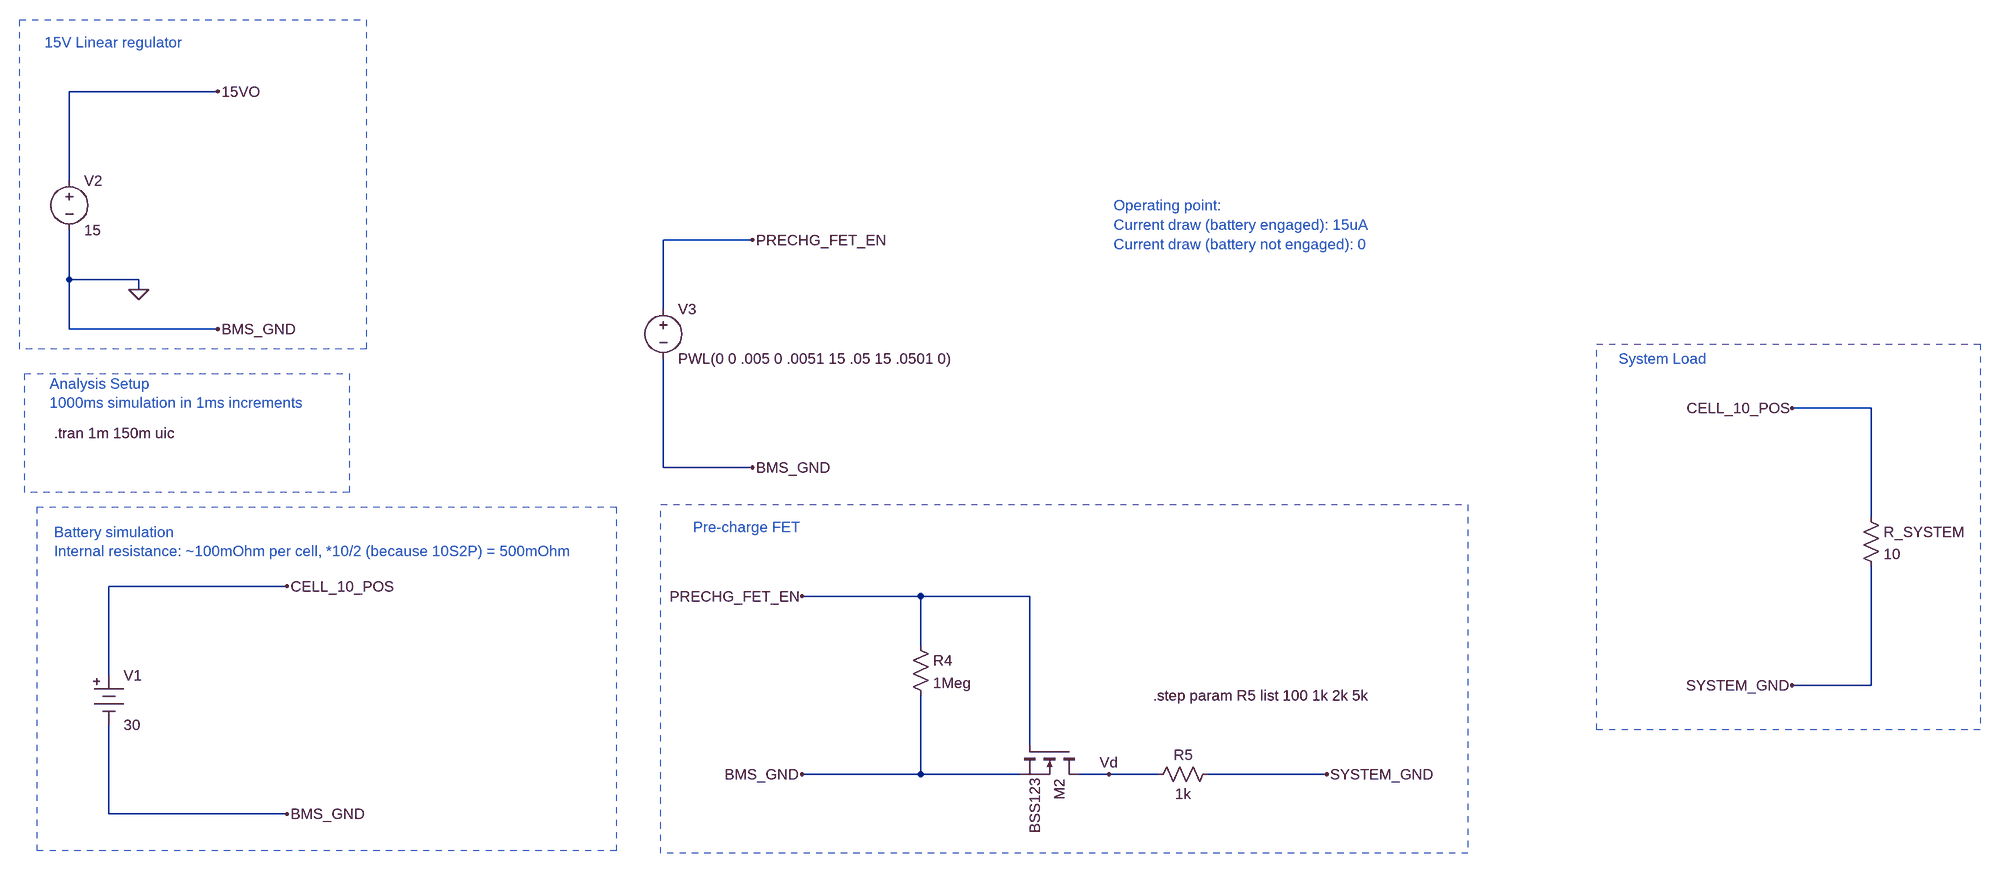
[diagram p0: schematic Pre-charge FET.asc]
Pre-charge FET.asc, the LTspice schematic file:
Version 4
SHEET 1 5144 2508
WIRE 352 416 112 416
WIRE 112 560 112 416
WIRE 1216 656 1072 656
WIRE 112 720 112 640
WIRE 224 720 112 720
WIRE 224 736 224 720
WIRE 1072 768 1072 656
WIRE 112 800 112 720
WIRE 352 800 112 800
WIRE 3024 928 2896 928
WIRE 1072 1024 1072 848
WIRE 1216 1024 1072 1024
WIRE 3024 1104 3024 928
WIRE 464 1216 176 1216
WIRE 1488 1232 1296 1232
WIRE 1664 1232 1488 1232
WIRE 1488 1312 1488 1232
WIRE 176 1360 176 1216
WIRE 3024 1376 3024 1184
WIRE 3024 1376 2896 1376
WIRE 1664 1472 1664 1232
WIRE 1488 1520 1488 1392
WIRE 1488 1520 1296 1520
WIRE 1648 1520 1488 1520
WIRE 1792 1520 1744 1520
WIRE 1872 1520 1792 1520
WIRE 2144 1520 1952 1520
WIRE 176 1584 176 1440
WIRE 464 1584 176 1584
FLAG 1296 1520 BMS_GND
FLAG 1296 1232 PRECHG_FET_EN
FLAG 2144 1520 SYSTEM_GND
FLAG 464 1216 CELL_10_POS
FLAG 464 1584 BMS_GND
FLAG 352 416 15VO
FLAG 352 800 BMS_GND
FLAG 1216 656 PRECHG_FET_EN
FLAG 1216 1024 BMS_GND
FLAG 2896 1376 SYSTEM_GND
FLAG 2896 928 CELL_10_POS
FLAG 224 736 0
FLAG 1792 1520 Vd
DATAFLAG 1488 1232 "$"
SYMBOL res 1472 1296 R0
SYMATTR InstName R4
SYMATTR Value 1Meg
SYMBOL res 1968 1504 R90
WINDOW 0 0 56 VBottom 2
WINDOW 3 32 56 VTop 2
SYMATTR InstName R5
SYMATTR Value 1k
SYMBOL nmos 1744 1472 R90
SYMATTR InstName M2
SYMATTR Value BSS123
SYMBOL battery 176 1344 R0
SYMATTR InstName V1
SYMATTR Value 30
SYMATTR SpiceLine Rser=500m
SYMBOL voltage 112 544 R0
SYMATTR InstName V2
SYMATTR Value 15
SYMBOL voltage 1072 752 R0
SYMATTR InstName V3
SYMATTR Value PWL(0 0 .005 0 .0051 15 .05 15 .0501 0)
SYMBOL res 3008 1088 R0
SYMATTR InstName R_SYSTEM
SYMATTR Value 10
TEXT 88 968 Left 2 !.tran 1m 150m uic
TEXT 88 1128 Left 2 ;Battery simulation\nInternal resistance: ~100mOhm per cell, *10/2 (because 10S2P) = 500mOhm
TEXT 1120 1120 Left 2 ;Pre-charge FET
TEXT 80 888 Left 2 ;Analysis Setup\n1000ms simulation in 1ms increments
TEXT 72 336 Left 2 ;15V Linear regulator
TEXT 2616 848 Left 2 ;System Load
TEXT 1864 1392 Left 2 !.step param R5 list 100 1k 2k 5k
TEXT 1800 600 Left 2 ;Operating point:\nCurrent draw (battery engaged): 15uA\nCurrent draw (battery not engaged): 0
RECTANGLE Normal 60 1088 996 1644 2
RECTANGLE Normal 1068 1084 2372 1648 2
RECTANGLE Normal 40 872 564 1064 2
RECTANGLE Normal 32 300 592 832 2
RECTANGLE Normal 2580 824 3200 1448 2

The netlist it stands for:
* Pre-charge FET.asc
R4 PRECHG_FET_EN 0 1Meg
R5 SYSTEM_GND Vd 1k
M2 Vd PRECHG_FET_EN 0 0 BSS123
V1 CELL_10_POS 0 30 Rser=500m
V2 15VO 0 15
V3 PRECHG_FET_EN 0 PWL(0 0 .005 0 .0051 15 .05 15 .0501 0)
R_SYSTEM CELL_10_POS SYSTEM_GND 10
.model NMOS NMOS
.model PMOS PMOS
.lib standard.mos
.tran 1m 150m uic
* Battery simulation
* Internal resistance: ~100mOhm per cell, *10/2 (because 10S2P) = 500mOhm
* Pre-charge FET
* Analysis Setup
* 1000ms simulation in 1ms increments
* 15V Linear regulator
* System Load
.step param R5 list 100 1k 2k 5k
* Operating point:
* Current draw (battery engaged): 15uA
* Current draw (battery not engaged): 0
.backanno
.end